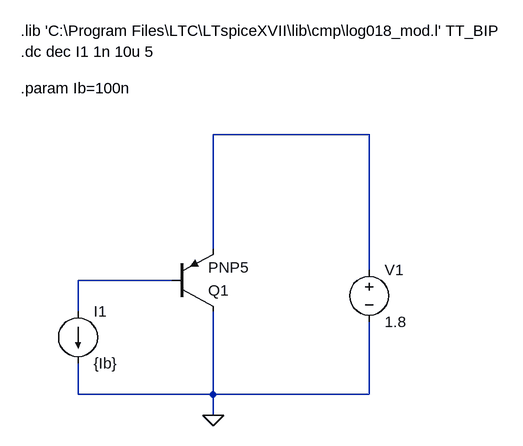
[diagram p0: schematic BJT_beta.asc]
BJT_beta.asc, the LTspice schematic file:
Version 4
SHEET 1 2248 788
WIRE 752 0 512 0
WIRE 512 176 512 0
WIRE 752 208 752 0
WIRE 448 224 304 224
WIRE 304 272 304 224
WIRE 304 400 304 352
WIRE 512 400 512 272
WIRE 512 400 304 400
WIRE 752 400 752 288
WIRE 752 400 512 400
WIRE 512 432 512 400
FLAG 512 432 0
SYMBOL pnp2 448 272 M180
SYMATTR InstName Q1
SYMATTR Value PNP5
SYMBOL voltage 752 192 R0
WINDOW 123 0 0 Left 2
WINDOW 39 0 0 Left 2
SYMATTR InstName V1
SYMATTR Value 1.8
SYMBOL current 304 272 R0
WINDOW 123 0 0 Left 2
WINDOW 39 0 0 Left 2
SYMATTR InstName I1
SYMATTR Value {Ib}
TEXT 216 -128 Left 2 !.dc dec I1 1n 10u 5
TEXT 216 -160 Left 2 !.lib 'C:\\Program Files\\LTC\\LTspiceXVII\\lib\\cmp\\log018_mod.l' TT_BIP
TEXT 216 -72 Left 2 !.param Ib=100n

The netlist it stands for:
* BJT_beta.asc
Q1 0 N002 N001 0 PNP5
V1 N001 0 1.8
I1 N002 0 {Ib}
.model NPN NPN
.model PNP PNP
.lib standard.bjt
.dc dec I1 1n 10u 5
.lib 'C:\Program Files\LTC\LTspiceXVII\lib\cmp\log018_mod.l' TT_BIP
.param Ib=100n
.backanno
.end